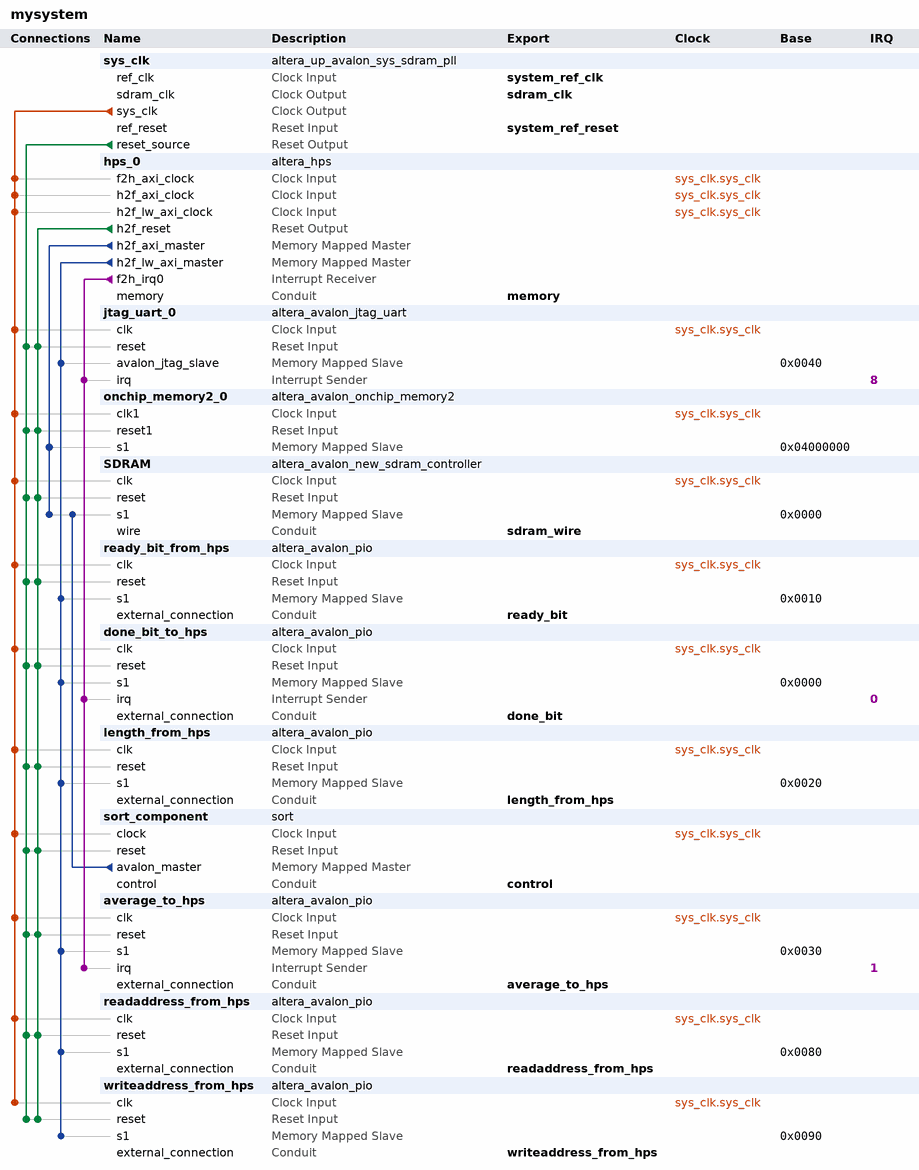
[diagram p0: system contents]
# Platform Designer (Qsys) system mysystem, Cyclone V 5CSEMA5F31C6
# Parameters at their usual value, and those the tool derives, are not listed.
package require -exact qsys 15.0
create_system mysystem
set_project_property DEVICE_FAMILY {Cyclone V}
set_project_property DEVICE 5CSEMA5F31C6

add_instance sys_clk altera_up_avalon_sys_sdram_pll 15.0
set_instance_parameter_value sys_clk CV_boards DE1-SoC
set_instance_parameter_value sys_clk gui_outclk 50.0
set_instance_parameter_value sys_clk gui_refclk 50.0

add_instance hps_0 altera_hps 15.0
set_instance_parameter_value hps_0 EMAC1_Mode N/A
set_instance_parameter_value hps_0 EMAC1_PinMuxing Unused
set_instance_parameter_value hps_0 F2SCLK_COLDRST_Enable false
set_instance_parameter_value hps_0 F2SCLK_DBGRST_Enable false
set_instance_parameter_value hps_0 F2SCLK_WARMRST_Enable false
set_instance_parameter_value hps_0 F2SINTERRUPT_Enable true
set_instance_parameter_value hps_0 F2S_Width 2
set_instance_parameter_value hps_0 FPGA_PERIPHERAL_OUTPUT_CLOCK_FREQ_EMAC0_GTX_CLK 100
set_instance_parameter_value hps_0 FPGA_PERIPHERAL_OUTPUT_CLOCK_FREQ_EMAC0_MD_CLK 2.5
set_instance_parameter_value hps_0 FPGA_PERIPHERAL_OUTPUT_CLOCK_FREQ_EMAC1_GTX_CLK 100
set_instance_parameter_value hps_0 FPGA_PERIPHERAL_OUTPUT_CLOCK_FREQ_EMAC1_MD_CLK 2.5
set_instance_parameter_value hps_0 HPS_PROTOCOL DDR3
set_instance_parameter_value hps_0 I2C0_Mode N/A
set_instance_parameter_value hps_0 I2C0_PinMuxing Unused
set_instance_parameter_value hps_0 I2C1_Mode N/A
set_instance_parameter_value hps_0 I2C1_PinMuxing Unused
set_instance_parameter_value hps_0 LWH2F_Enable true
set_instance_parameter_value hps_0 MEM_BANKADDR_WIDTH 3
set_instance_parameter_value hps_0 MEM_CLK_FREQ 300.0
set_instance_parameter_value hps_0 MEM_CLK_FREQ_MAX 400.0
set_instance_parameter_value hps_0 MEM_COL_ADDR_WIDTH 8
set_instance_parameter_value hps_0 MEM_DQ_WIDTH 8
set_instance_parameter_value hps_0 MEM_DRV_STR RZQ/6
set_instance_parameter_value hps_0 MEM_ROW_ADDR_WIDTH 12
set_instance_parameter_value hps_0 MEM_RTT_NOM RZQ/6
set_instance_parameter_value hps_0 MEM_RTT_WR {Dynamic ODT off}
set_instance_parameter_value hps_0 MEM_TCL 7
set_instance_parameter_value hps_0 MEM_TFAW_NS 37.5
set_instance_parameter_value hps_0 MEM_TINIT_US 499
set_instance_parameter_value hps_0 MEM_TMRD_CK 3
set_instance_parameter_value hps_0 MEM_TRAS_NS 40.0
set_instance_parameter_value hps_0 MEM_TRCD_NS 15.0
set_instance_parameter_value hps_0 MEM_TREFI_US 7.0
set_instance_parameter_value hps_0 MEM_TRFC_NS 75.0
set_instance_parameter_value hps_0 MEM_TRP_NS 15.0
set_instance_parameter_value hps_0 MEM_TWTR 2
set_instance_parameter_value hps_0 MEM_VENDOR JEDEC
set_instance_parameter_value hps_0 MEM_WTCL 6
set_instance_parameter_value hps_0 QSPI_Mode N/A
set_instance_parameter_value hps_0 QSPI_PinMuxing Unused
set_instance_parameter_value hps_0 REF_CLK_FREQ 125.0
set_instance_parameter_value hps_0 S2F_Width 3
set_instance_parameter_value hps_0 SDIO_Mode N/A
set_instance_parameter_value hps_0 SDIO_PinMuxing Unused
set_instance_parameter_value hps_0 SPIM1_Mode N/A
set_instance_parameter_value hps_0 SPIM1_PinMuxing Unused
set_instance_parameter_value hps_0 STM_Enable false
set_instance_parameter_value hps_0 TIMING_BOARD_AC_SKEW 0.02
set_instance_parameter_value hps_0 TIMING_BOARD_AC_TO_CK_SKEW 0.0
set_instance_parameter_value hps_0 TIMING_BOARD_DQ_TO_DQS_SKEW 0.0
set_instance_parameter_value hps_0 TIMING_BOARD_MAX_CK_DELAY 0.6
set_instance_parameter_value hps_0 TIMING_BOARD_MAX_DQS_DELAY 0.6
set_instance_parameter_value hps_0 TIMING_BOARD_SKEW_BETWEEN_DQS 0.02
set_instance_parameter_value hps_0 TIMING_BOARD_SKEW_CKDQS_DIMM_MAX 0.01
set_instance_parameter_value hps_0 TIMING_BOARD_SKEW_CKDQS_DIMM_MIN -0.01
set_instance_parameter_value hps_0 TIMING_BOARD_SKEW_WITHIN_DQS 0.02
set_instance_parameter_value hps_0 TIMING_TDH 125
set_instance_parameter_value hps_0 TIMING_TDQSCK 400
set_instance_parameter_value hps_0 TIMING_TDQSQ 120
set_instance_parameter_value hps_0 TIMING_TDS 50
set_instance_parameter_value hps_0 TIMING_TIH 250
set_instance_parameter_value hps_0 TIMING_TIS 175
set_instance_parameter_value hps_0 TIMING_TQSH 0.38
set_instance_parameter_value hps_0 UART0_Mode N/A
set_instance_parameter_value hps_0 UART0_PinMuxing Unused
set_instance_parameter_value hps_0 USB1_Mode N/A
set_instance_parameter_value hps_0 USB1_PinMuxing Unused
set_instance_parameter_value hps_0 desired_cfg_clk_mhz 100.0
set_instance_parameter_value hps_0 desired_qspi_clk_mhz 400.0

add_instance jtag_uart_0 altera_avalon_jtag_uart 15.0
set_instance_parameter_value jtag_uart_0 simInteractiveOptions NO_INTERACTIVE_WINDOWS

add_instance onchip_memory2_0 altera_avalon_onchip_memory2 15.0
set_instance_parameter_value onchip_memory2_0 dataWidth 32
set_instance_parameter_value onchip_memory2_0 dualPort false
set_instance_parameter_value onchip_memory2_0 initMemContent true
set_instance_parameter_value onchip_memory2_0 initializationFileName onchip_mem.hex
set_instance_parameter_value onchip_memory2_0 memorySize 16384

add_instance SDRAM altera_avalon_new_sdram_controller 15.0
set_instance_parameter_value SDRAM TAC 5.5
set_instance_parameter_value SDRAM TRCD 20.0
set_instance_parameter_value SDRAM TRP 20.0
set_instance_parameter_value SDRAM casLatency 3
set_instance_parameter_value SDRAM columnWidth 10
set_instance_parameter_value SDRAM dataWidth 16
set_instance_parameter_value SDRAM generateSimulationModel true
set_instance_parameter_value SDRAM model single_Micron_MT48LC4M32B2_7_chip
set_instance_parameter_value SDRAM numberOfBanks 4
set_instance_parameter_value SDRAM numberOfChipSelects 1
set_instance_parameter_value SDRAM powerUpDelay 100.0
set_instance_parameter_value SDRAM refreshPeriod 15.625
set_instance_parameter_value SDRAM rowWidth 13

add_instance ready_bit_from_hps altera_avalon_pio 15.0
set_instance_parameter_value ready_bit_from_hps bitClearingEdgeCapReg true
set_instance_parameter_value ready_bit_from_hps captureEdge true
set_instance_parameter_value ready_bit_from_hps direction Output
set_instance_parameter_value ready_bit_from_hps edgeType FALLING
set_instance_parameter_value ready_bit_from_hps generateIRQ true
set_instance_parameter_value ready_bit_from_hps irqType EDGE
set_instance_parameter_value ready_bit_from_hps simDoTestBenchWiring true
set_instance_parameter_value ready_bit_from_hps width 1

add_instance done_bit_to_hps altera_avalon_pio 15.0
set_instance_parameter_value done_bit_to_hps bitClearingEdgeCapReg true
set_instance_parameter_value done_bit_to_hps captureEdge true
set_instance_parameter_value done_bit_to_hps direction Input
set_instance_parameter_value done_bit_to_hps edgeType FALLING
set_instance_parameter_value done_bit_to_hps generateIRQ true
set_instance_parameter_value done_bit_to_hps irqType EDGE
set_instance_parameter_value done_bit_to_hps simDoTestBenchWiring true
set_instance_parameter_value done_bit_to_hps width 1

add_instance length_from_hps altera_avalon_pio 15.0
set_instance_parameter_value length_from_hps bitClearingEdgeCapReg true
set_instance_parameter_value length_from_hps captureEdge true
set_instance_parameter_value length_from_hps direction Output
set_instance_parameter_value length_from_hps edgeType FALLING
set_instance_parameter_value length_from_hps generateIRQ true
set_instance_parameter_value length_from_hps irqType EDGE
set_instance_parameter_value length_from_hps simDoTestBenchWiring true
set_instance_parameter_value length_from_hps width 7

add_instance sort_component sort 1.0

add_instance average_to_hps altera_avalon_pio 15.0
set_instance_parameter_value average_to_hps bitClearingEdgeCapReg true
set_instance_parameter_value average_to_hps captureEdge true
set_instance_parameter_value average_to_hps direction Input
set_instance_parameter_value average_to_hps edgeType FALLING
set_instance_parameter_value average_to_hps generateIRQ true
set_instance_parameter_value average_to_hps irqType EDGE
set_instance_parameter_value average_to_hps simDoTestBenchWiring true
set_instance_parameter_value average_to_hps width 16

add_instance readaddress_from_hps altera_avalon_pio 15.0
set_instance_parameter_value readaddress_from_hps bitClearingEdgeCapReg true
set_instance_parameter_value readaddress_from_hps captureEdge true
set_instance_parameter_value readaddress_from_hps direction Output
set_instance_parameter_value readaddress_from_hps edgeType FALLING
set_instance_parameter_value readaddress_from_hps generateIRQ true
set_instance_parameter_value readaddress_from_hps irqType EDGE
set_instance_parameter_value readaddress_from_hps simDoTestBenchWiring true
set_instance_parameter_value readaddress_from_hps width 32

add_instance writeaddress_from_hps altera_avalon_pio 15.0
set_instance_parameter_value writeaddress_from_hps bitClearingEdgeCapReg true
set_instance_parameter_value writeaddress_from_hps captureEdge true
set_instance_parameter_value writeaddress_from_hps direction Output
set_instance_parameter_value writeaddress_from_hps edgeType FALLING
set_instance_parameter_value writeaddress_from_hps generateIRQ true
set_instance_parameter_value writeaddress_from_hps irqType EDGE
set_instance_parameter_value writeaddress_from_hps simDoTestBenchWiring true
set_instance_parameter_value writeaddress_from_hps width 32

# connections
add_connection sys_clk.sys_clk average_to_hps.clk clock
add_connection sys_clk.sys_clk done_bit_to_hps.clk clock
add_connection sys_clk.sys_clk hps_0.f2h_axi_clock clock
add_connection sys_clk.sys_clk hps_0.h2f_axi_clock clock
add_connection sys_clk.sys_clk hps_0.h2f_lw_axi_clock clock
add_connection sys_clk.sys_clk jtag_uart_0.clk clock
add_connection sys_clk.sys_clk length_from_hps.clk clock
add_connection sys_clk.sys_clk onchip_memory2_0.clk1 clock
add_connection sys_clk.sys_clk readaddress_from_hps.clk clock
add_connection sys_clk.sys_clk ready_bit_from_hps.clk clock
add_connection sys_clk.sys_clk SDRAM.clk clock
add_connection sys_clk.sys_clk sort_component.clock clock
add_connection sys_clk.sys_clk writeaddress_from_hps.clk clock
add_connection hps_0.h2f_reset average_to_hps.reset reset
add_connection hps_0.h2f_reset done_bit_to_hps.reset reset
add_connection hps_0.h2f_reset jtag_uart_0.reset reset
add_connection hps_0.h2f_reset length_from_hps.reset reset
add_connection hps_0.h2f_reset onchip_memory2_0.reset1 reset
add_connection hps_0.h2f_reset readaddress_from_hps.reset reset
add_connection hps_0.h2f_reset ready_bit_from_hps.reset reset
add_connection hps_0.h2f_reset SDRAM.reset reset
add_connection hps_0.h2f_reset sort_component.reset reset
add_connection hps_0.h2f_reset writeaddress_from_hps.reset reset
add_connection sys_clk.reset_source average_to_hps.reset reset
add_connection sys_clk.reset_source done_bit_to_hps.reset reset
add_connection sys_clk.reset_source jtag_uart_0.reset reset
add_connection sys_clk.reset_source length_from_hps.reset reset
add_connection sys_clk.reset_source onchip_memory2_0.reset1 reset
add_connection sys_clk.reset_source readaddress_from_hps.reset reset
add_connection sys_clk.reset_source ready_bit_from_hps.reset reset
add_connection sys_clk.reset_source SDRAM.reset reset
add_connection sys_clk.reset_source sort_component.reset reset
add_connection sys_clk.reset_source writeaddress_from_hps.reset reset
add_connection hps_0.h2f_axi_master onchip_memory2_0.s1 avalon
set_connection_parameter_value hps_0.h2f_axi_master/onchip_memory2_0.s1 baseAddress 0x04000000
add_connection hps_0.h2f_axi_master SDRAM.s1 avalon
set_connection_parameter_value hps_0.h2f_axi_master/SDRAM.s1 baseAddress 0x0000
add_connection hps_0.h2f_lw_axi_master average_to_hps.s1 avalon
set_connection_parameter_value hps_0.h2f_lw_axi_master/average_to_hps.s1 baseAddress 0x0030
add_connection hps_0.h2f_lw_axi_master done_bit_to_hps.s1 avalon
set_connection_parameter_value hps_0.h2f_lw_axi_master/done_bit_to_hps.s1 baseAddress 0x0000
add_connection hps_0.h2f_lw_axi_master jtag_uart_0.avalon_jtag_slave avalon
set_connection_parameter_value hps_0.h2f_lw_axi_master/jtag_uart_0.avalon_jtag_slave baseAddress 0x0040
add_connection hps_0.h2f_lw_axi_master length_from_hps.s1 avalon
set_connection_parameter_value hps_0.h2f_lw_axi_master/length_from_hps.s1 baseAddress 0x0020
add_connection hps_0.h2f_lw_axi_master readaddress_from_hps.s1 avalon
set_connection_parameter_value hps_0.h2f_lw_axi_master/readaddress_from_hps.s1 baseAddress 0x0080
add_connection hps_0.h2f_lw_axi_master ready_bit_from_hps.s1 avalon
set_connection_parameter_value hps_0.h2f_lw_axi_master/ready_bit_from_hps.s1 baseAddress 0x0010
add_connection hps_0.h2f_lw_axi_master writeaddress_from_hps.s1 avalon
set_connection_parameter_value hps_0.h2f_lw_axi_master/writeaddress_from_hps.s1 baseAddress 0x0090
add_connection sort_component.avalon_master SDRAM.s1 avalon
set_connection_parameter_value sort_component.avalon_master/SDRAM.s1 baseAddress 0x0000
add_connection hps_0.f2h_irq0 average_to_hps.irq interrupt
set_connection_parameter_value hps_0.f2h_irq0/average_to_hps.irq irqNumber 1
add_connection hps_0.f2h_irq0 done_bit_to_hps.irq interrupt
set_connection_parameter_value hps_0.f2h_irq0/done_bit_to_hps.irq irqNumber 0
add_connection hps_0.f2h_irq0 jtag_uart_0.irq interrupt
set_connection_parameter_value hps_0.f2h_irq0/jtag_uart_0.irq irqNumber 8

# exported interfaces
add_interface average_to_hps conduit end
set_interface_property average_to_hps EXPORT_OF average_to_hps.external_connection
add_interface control conduit end
set_interface_property control EXPORT_OF sort_component.control
add_interface done_bit conduit end
set_interface_property done_bit EXPORT_OF done_bit_to_hps.external_connection
add_interface length_from_hps conduit end
set_interface_property length_from_hps EXPORT_OF length_from_hps.external_connection
add_interface memory conduit end
set_interface_property memory EXPORT_OF hps_0.memory
add_interface readaddress_from_hps conduit end
set_interface_property readaddress_from_hps EXPORT_OF readaddress_from_hps.external_connection
add_interface ready_bit conduit end
set_interface_property ready_bit EXPORT_OF ready_bit_from_hps.external_connection
add_interface sdram_clk clock source
set_interface_property sdram_clk EXPORT_OF sys_clk.sdram_clk
add_interface sdram_wire conduit end
set_interface_property sdram_wire EXPORT_OF SDRAM.wire
add_interface system_ref_clk clock sink
set_interface_property system_ref_clk EXPORT_OF sys_clk.ref_clk
add_interface system_ref_reset reset sink
set_interface_property system_ref_reset EXPORT_OF sys_clk.ref_reset
add_interface writeaddress_from_hps conduit end
set_interface_property writeaddress_from_hps EXPORT_OF writeaddress_from_hps.external_connection

set_interconnect_requirement {$system} qsys_mm.clockCrossingAdapter HANDSHAKE
set_interconnect_requirement {$system} qsys_mm.enableEccProtection FALSE
set_interconnect_requirement {$system} qsys_mm.insertDefaultSlave FALSE
set_interconnect_requirement {$system} qsys_mm.maxAdditionalLatency 1

save_system mysystem.qsys
